# Altium project PreCharge.PrjPcb (part 2 of 2)

## Sheet Motor Interface - Thermistors.SchDoc
size B
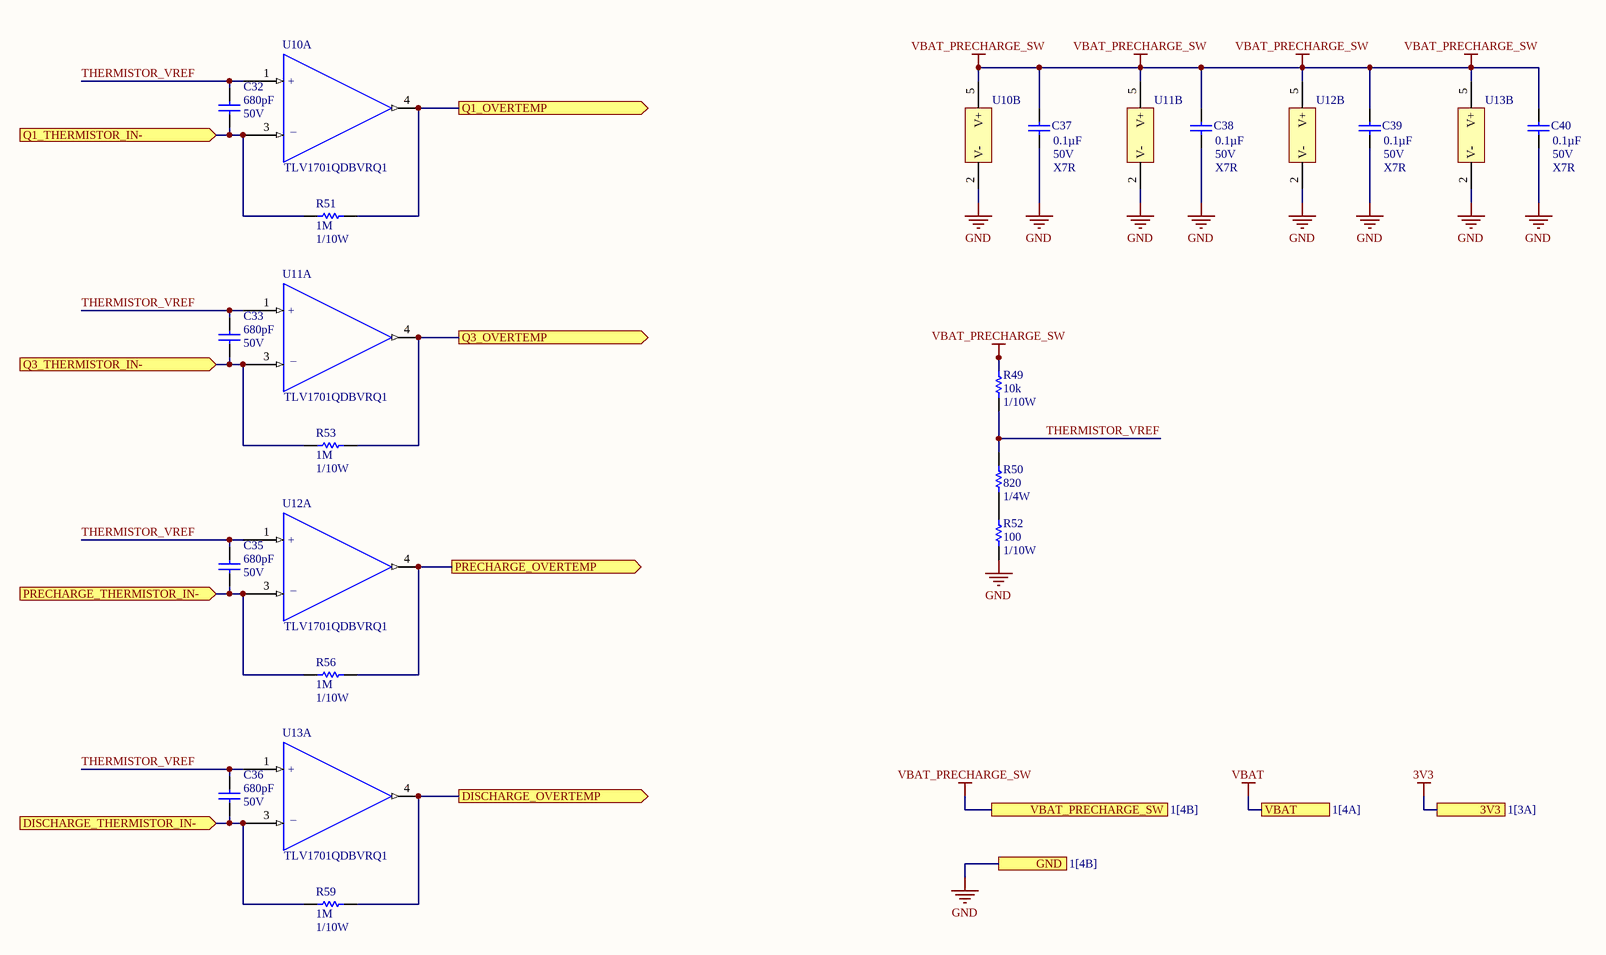
[diagram p4: Motor Interface - Thermistors.SchDoc]

### Parts
C32  Voltage: 50V  Capacitance: 680pF  [CAP, 0603]  (hidden comment: CAP CER 680PF 50V C0G/NP0 0603)
C33  Voltage: 50V  Capacitance: 680pF  [CAP, 0603]  (hidden comment: CAP CER 680PF 50V C0G/NP0 0603)
C35  Voltage: 50V  Capacitance: 680pF  [CAP, 0603]  (hidden comment: CAP CER 680PF 50V C0G/NP0 0603)
C36  Voltage: 50V  Capacitance: 680pF  [CAP, 0603]  (hidden comment: CAP CER 680PF 50V C0G/NP0 0603)
C37  Voltage: 50V  Capacitance: 0.1µF  Temperature Coefficient: X7R  [CAP, 0603]  (hidden comment: CAP CER 0.1UF 50V 10% X7R 0603)
C38  Voltage: 50V  Capacitance: 0.1µF  Temperature Coefficient: X7R  [CAP, 0603]  (hidden comment: CAP CER 0.1UF 50V 10% X7R 0603)
C39  Voltage: 50V  Capacitance: 0.1µF  Temperature Coefficient: X7R  [CAP, 0603]  (hidden comment: CAP CER 0.1UF 50V 10% X7R 0603)
C40  Voltage: 50V  Capacitance: 0.1µF  Temperature Coefficient: X7R  [CAP, 0603]  (hidden comment: CAP CER 0.1UF 50V 10% X7R 0603)
R49  Resistance: 10k  Power: 1/10W  [RES, 0603]  (hidden comment: RES 10K OHM 1% 1/10W 0603)
R50  Resistance: 820  Power: 1/4W  [RES, 0603]  (hidden comment: RES 820 OHM 5% 1/4W 0603)
R51  Resistance (Ohms): 1M  Power (Watts): 1/10W  [RES, 0603]  (hidden comment: RES 1M OHM 1% 1/10W 0603)
R52  Resistance: 100  Power: 1/10W  [RES, 0603]  (hidden comment: RES 100 OHM 1% 1/10W 0603)
R53  Resistance (Ohms): 1M  Power (Watts): 1/10W  [RES, 0603]  (hidden comment: RES 1M OHM 1% 1/10W 0603)
R56  Resistance (Ohms): 1M  Power (Watts): 1/10W  [RES, 0603]  (hidden comment: RES 1M OHM 1% 1/10W 0603)
R59  Resistance (Ohms): 1M  Power (Watts): 1/10W  [RES, 0603]  (hidden comment: RES 1M OHM 1% 1/10W 0603)
U10  Manufacturer Part Number: TLV1701QDBVRQ1  [SOT95P280X145-5N]  (hidden comment: IC COMPARATOR TLV1701 SOT-23-5)  (parts A,B of 2)
U11  Manufacturer Part Number: TLV1701QDBVRQ1  [SOT95P280X145-5N]  (hidden comment: IC COMPARATOR TLV1701 SOT-23-5)  (parts A,B of 2)
U12  Manufacturer Part Number: TLV1701QDBVRQ1  [SOT95P280X145-5N]  (hidden comment: IC COMPARATOR TLV1701 SOT-23-5)  (parts A,B of 2)
U13  Manufacturer Part Number: TLV1701QDBVRQ1  [SOT95P280X145-5N]  (hidden comment: IC COMPARATOR TLV1701 SOT-23-5)  (parts A,B of 2)

### Ports
3V3 (see 1[3A]), DISCHARGE_OVERTEMP (out), DISCHARGE_THERMISTOR_IN- (in), GND (see 1[4B]), PRECHARGE_OVERTEMP (out), PRECHARGE_THERMISTOR_IN- (in), Q1_OVERTEMP (out), Q1_THERMISTOR_IN- (in), Q3_OVERTEMP (out), Q3_THERMISTOR_IN- (in), VBAT (see 1[4A]), VBAT_PRECHARGE_SW (see 1[4B])

### Nets
GND: C37.1 C38.1 C39.1 C40.1 R52.2 U10.2(V-) U11.2(V-) U12.2(V-) U13.2(V-) ; port GND
VBAT_PRECHARGE_SW: C37.2 C38.2 C39.2 C40.2 R49.1 U10.5(V+) U11.5(V+) U12.5(V+) U13.5(V+) ; port VBAT_PRECHARGE_SW
DISCHARGE_OVERTEMP: R59.2 U13.4(OUT) ; port DISCHARGE_OVERTEMP
DISCHARGE_THERMISTOR_IN-: C36.2 R59.1 U13.3(-IN) ; port DISCHARGE_THERMISTOR_IN-
PRECHARGE_OVERTEMP: R56.2 U12.4(OUT) ; port PRECHARGE_OVERTEMP
PRECHARGE_THERMISTOR_IN-: C35.2 R56.1 U12.3(-IN) ; port PRECHARGE_THERMISTOR_IN-
Q1_OVERTEMP: R51.2 U10.4(OUT) ; port Q1_OVERTEMP
Q1_THERMISTOR_IN-: C32.2 R51.1 U10.3(-IN) ; port Q1_THERMISTOR_IN-
Q3_OVERTEMP: R53.2 U11.4(OUT) ; port Q3_OVERTEMP
Q3_THERMISTOR_IN-: C33.2 R53.1 U11.3(-IN) ; port Q3_THERMISTOR_IN-
THERMISTOR_VREF: C32.1 C33.1 C35.1 C36.1 R49.2 R50.1 U10.1(+IN) U11.1(+IN) U12.1(+IN) U13.1(+IN)
NetR50_2: R50.2 R52.1

### Notes on the sheet
- PROJECT
- DOCUMENT
- DRAWN BY
- LAST MODIFIED
- PART NUMBER
- REVISION
- SHEET
- VARIANT
- OF
- Engineering 5 - 1002
  University of Waterloo
  (519) 888-4567 x32978
  hardware@uwmidsun.com
- (in symbol IC COMPARATOR TLV1701 SOT-23-5, part A) +; _

### Library data of the parts
C32 C33 C35 C36 = CAP CER 680PF 50V C0G 0603: 680pF ±5% 50V Ceramic Capacitor C0G, NP0 0603 (1608 Metric); Manufacturer: Samsung; Manufacturer Part Number: CL10C681JB8NNNC; Temperature Coefficient: 300ppm/°C; Supplier 1: Digi-Key; Stock 1: 40000; Pricing 1: 1=0.16, 10=0.112, 100=0.0526, 500=0.0369, 1000=0.03055 (USD); Mount: Surface Mount; Case/Package: 0603; Case Code (Metric): 1608; Case Code (Imperial): 0603; Min Operating Temperature: -55°C; Max Operating Temperature: 125°C; Tolerance: 5%; Packaging: Tape and Reel; Voltage Rating: 50V; Voltage Rating (DC): 50V; Length: 1.6mm; Height: 0.8mm; Width: 0.031inch; Thickness: 0.035inch; Depth: 0.8mm; Radiation Hardening: No; ComponentLink1URL: http://www.samsungsem.com/kr/support/product-search/mlcc/CL10C681JB8NNNC.jsp; ComponentLink1Description: http://www.samsungsem.com/kr/support/product-search/mlcc/CL10C681JB8NNNC.jsp; ComponentLink2URL: https://www.verical.com/server-webapp/html/getDatasheet?partID=359565; ComponentLink2Description: https://www.verical.com/server-webapp/html/getDatasheet?partID=359565; ComponentLink3URL: http://www1.futureelectronics.com/doc/SAMSUNG%20PASSIVE/CL05B104KQ5NNNC.pdf; ComponentLink3Description: http://www1.futureelectronics.com/doc/SAMSUNG%20PASSIVE/CL05B104KQ5NNNC.pdf; ComponentLink4URL: http://www.rapidonline.com/pdf/71-0310.pdf; ComponentLink4Description: http://www.rapidonline.com/pdf/71-0310.pdf; ComponentLink5URL: https://www.distrelec.biz/Web/Downloads/_e/ng/MLCC_CatalogDownload2013_ENG.pdf?mime=application%2Fpdf; ComponentLink5Description: https://www.distrelec.biz/Web/Downloads/_e/ng/MLCC_CatalogDownload2013_ENG.pdf?mime=application%2Fpdf; ComponentLink6URL: https://produktinfo.conrad.com/datenblaetter/450000-474999/456146-da-01-en-VS_KONDENSATOR_0603.pdf; ComponentLink6Description: https://produktinfo.conrad.com/datenblaetter/450000-474999/456146-da-01-en-VS_KONDENSATOR_0603.pdf; Supplier Part Number 1: 1276-1820-1-ND; Dielectric: C0G; Material: Ceramic; Lead Free: Lead Free
C37-C40 = CAP CER 0.1UF 50V 10% X7R 0603: 0.10µF ±10% 50V Ceramic Capacitor X7R 0603 (1608 Metric); Manufacturer 1: AVX Corporation; Manufacturer Part Number 1: 06035C104KAT2A; Supplier 1: Digi-Key; Supplier Part Number 1: 478-5052-1-ND; Packaging: Cut Tape (CT); Part Status: Active; Operating Temperature: -55°C ~ 125°C; Ratings: -; Mounting Type: Surface Mount, MLCC; Package / Case: 0603 (1608 Metric); Size / Dimension: 0.063" L x 0.032" W (1.60mm x 0.81mm); Height - Seated (Max): -; Thickness (Max): 0.035" (0.90mm); Lead Spacing: -; Lead Style: -; ComponentLink1URL: http://datasheets.avx.com/X7RDielectric.pdf; ComponentLink1Description: http://datasheets.avx.com/X7RDielectric.pdf; Tolerance: ±10%
R49 = RES 10K OHM 1% 1/10W 0603: RES SMD 10K OHM 1% 1/10W 0603; Manufacturer 1: Yageo; Manufacturer Part Number 1: RC0603FR-0710KL; Temperature Coefficient: ±100ppm/°C; Supplier 1: Digi-Key; Supplier Part Number 1: 311-10.0KHRCT-ND; Packaging: Cut Tape (CT); Part Status: Active; Composition: Thick Film; Operating Temperature: -55°C ~ 155°C; Package / Case: 0603 (1608 Metric); Supplier Device Package: 0603; Size / Dimension: 0.063" L x 0.031" W (1.60mm x 0.80mm); Height - Seated (Max): 0.022" (0.55mm); Failure Rate: -; ComponentLink1URL: http://www.yageo.com/documents/recent/PYu-RC_Group_51_RoHS_L_7.pdf; ComponentLink1Description: http://www.yageo.com/documents/recent/PYu-RC_Group_51_RoHS_L_7.pdf; Tolerance: ±1%
R50 = RES 820 OHM 5% 1/4W 0603: RES SMD 820 OHM 5% 1/4W 0603; Manufacturer 1: Rohm Semiconductor; Manufacturer Part Number 1: ESR03EZPJ821; Temperature Coefficient: ±200ppm/°C; Supplier 1: Digi-Key; Supplier Part Number 1: RHM820DCT-ND; Packaging: Cut Tape (CT); Part Status: Active; Composition: Thick Film; Operating Temperature: -55°C ~ 155°C; Package / Case: 0603 (1608 Metric); Supplier Device Package: 0603; Size / Dimension: 0.063" L x 0.031" W (1.60mm x 0.80mm); Height - Seated (Max): 0.022" (0.55mm); Failure Rate: -; ComponentLink1URL: http://www.rohm.com/web/global/datasheet/ESR01MZPF/esr-e; ComponentLink1Description: http://www.rohm.com/web/global/datasheet/ESR01MZPF/esr-e; Tolerance: ±5%
R51 R53 R56 R59 = RES 1M OHM 1% 1/10W 0603: 1M Ohm ±1% 0.1W, 1/10W Chip Resistor 0603 (1608 Metric) Moisture Resistant Thick Film; Manufacturer 1: Yageo; Manufacturer Part Number 1: RC0603FR-071ML; Temperature Coefficient: ±100ppm/°C; Description 1: RES SMD 1M OHM 1% 1/10W 0603; Supplier 1: Digi-Key; Supplier Part Number 1: 311-1.00MHRCT-ND; Packaging: Cut Tape (CT); Part Status: Active; Composition: Thick Film; Operating Temperature: -55°C ~ 155°C; Package / Case: 0603 (1608 Metric); Supplier Device Package: 0603; Size / Dimension: 0.063" L x 0.031" W (1.60mm x 0.80mm); Height - Seated (Max): 0.022" (0.55mm); Failure Rate: -; ComponentLink1URL: http://www.yageo.com/documents/recent/PYu-RC_Group_51_RoHS_L_7.pdf; ComponentLink1Description: http://www.yageo.com/documents/recent/PYu-RC_Group_51_RoHS_L_7.pdf; Tolerance: ±1%; RoHS: RoHS Compliant; Category: Resistors; Stock 1: 2336711; Pricing 1: 1=0.16, 10=0.022, 100=0.0089, 1000=0.00402, 2500=0.00349 (CAD); Features: Moisture Resistant
R52 = RES 100 OHM 1% 1/10W 0603: 100 Ohm ±1% 0.1W, 1/10W Chip Resistor 0603 (1608 Metric) Moisture Resistant Thick Film; Manufacturer 1: Yageo; Manufacturer Part Number 1: RC0603FR-07100RL; Temperature Coefficient: ±100ppm/°C; Supplier 1: Digi-Key; Supplier Part Number 1: 311-100HRCT-ND; Packaging: Cut Tape (CT); Part Status: Active; Composition: Thick Film; Operating Temperature: -55°C ~ 155°C; Package / Case: 0603 (1608 Metric); Supplier Device Package: 0603; Size / Dimension: 0.063" L x 0.031" W (1.60mm x 0.80mm); Height - Seated (Max): 0.022" (0.55mm); Failure Rate: -; ComponentLink1URL: http://www.yageo.com/documents/recent/PYu-RC_Group_51_RoHS_L_7.pdf; ComponentLink1Description: http://www.yageo.com/documents/recent/PYu-RC_Group_51_RoHS_L_7.pdf; Tolerance: ±1%
U10-U13 = IC COMPARATOR TLV1701 SOT-23-5: Comparator General Purpose Open Collector SOT-23-5; Manufacturer: Texas Instruments; Number of Channels: 1; Supplier 1: Digi-Key; Supplier Part Number 1: 296-47458-1-ND; Stock 1: 8944; Min Operating Temperature: -40°C; Max Operating Temperature: 125°C; ComponentLink1Description: Datasheet; ComponentLink1URL: http://www.ti.com/lit/ds/symlink/tlv1701-q1.pdf

## Nets that join several sheets
3V3: Motor Interface - CAN (7 pins), Motor Interface - Pre-Charge Interface (5 pins), Motor Interface - Connectors (7 pins)
GND: Motor Interface - CAN (8 pins), Motor Interface - Pre-Charge Interface (12 pins), Motor Interface - Connectors (17 pins), Motor Interface - Thermistors (9 pins)
VBAT: Motor Interface - Pre-Charge Interface (U3.1 U3.9 U14.1 U14.9), Motor Interface - Connectors (12 pins)
VBAT_PRECHARGE_SW: Motor Interface - Pre-Charge Interface (R3.1 U3.7 U3.8), Motor Interface - Connectors (P6.1), Motor Interface - Thermistors (9 pins)
CONTACTOR_SENSE_IN: Motor Interface - Pre-Charge Interface (C9.1 R5.1 R36.2), Motor Interface - Connectors (P6.4)
MOTOR_CONTROLLER_CAN_N: Motor Interface - CAN (U2.6), Motor Interface - Connectors (D2.1 D3.1 P3.4 P5.4)
MOTOR_CONTROLLER_CAN_P: Motor Interface - CAN (U2.7), Motor Interface - Connectors (D2.2 D3.2 P3.3 P5.3)
PA8_nCAN_INTERRUPT: Motor Interface - CAN (TP6.TP U1.13), Motor Interface - Connectors (P1.7)
PA9_PRECHARGE_EN: Motor Interface - Pre-Charge Interface (R4.1 U3.2), Motor Interface - Connectors (P1.6)
PA10_CONTACTOR_MONITOR: Motor Interface - Pre-Charge Interface (C27.1 R36.1), Motor Interface - Connectors (P1.5)
PB10_nRX0BF: Motor Interface - CAN (U1.12), Motor Interface - Connectors (P1.14)
PB11_nRX1BF: Motor Interface - CAN (U1.11), Motor Interface - Connectors (P1.13)
PB12_SPI2_NSS: Motor Interface - CAN (TP5.TP U1.18), Motor Interface - Connectors (P1.11)
PB13_SPI2_SCK: Motor Interface - CAN (TP2.TP U1.14), Motor Interface - Connectors (P1.10)
PB14_SPI2_MISO: Motor Interface - CAN (TP4.TP U1.17), Motor Interface - Connectors (P1.9)
PB15_SPI2_MOSI: Motor Interface - CAN (TP3.TP U1.16), Motor Interface - Connectors (P1.8)

## Assembly variants
01 - Standard: not fitted C?